# Altium schematic sheet S03-MICROPHONE.SchDoc
size B; SheetNumber: 4; SheetTotal: 5; BLOCK-TITLE: MICROPHONE AND ADJUSTABLE GAIN AMPLIFIER; BLOCK-SIZE: B; BLOCK-PROJECT: MULTIMOD AUDIO MODULE; BLOCK-REVISION: 1; BLOCK-ORGANIZATION: UNIVERSITY OF FLORIDA; BLOCK-DESIGNER: MEHRON TALEBI; BLOCK-IDENTIFIER: SUMMER 2023; BLOCK-REVIEWER: MIKE STAPLETON
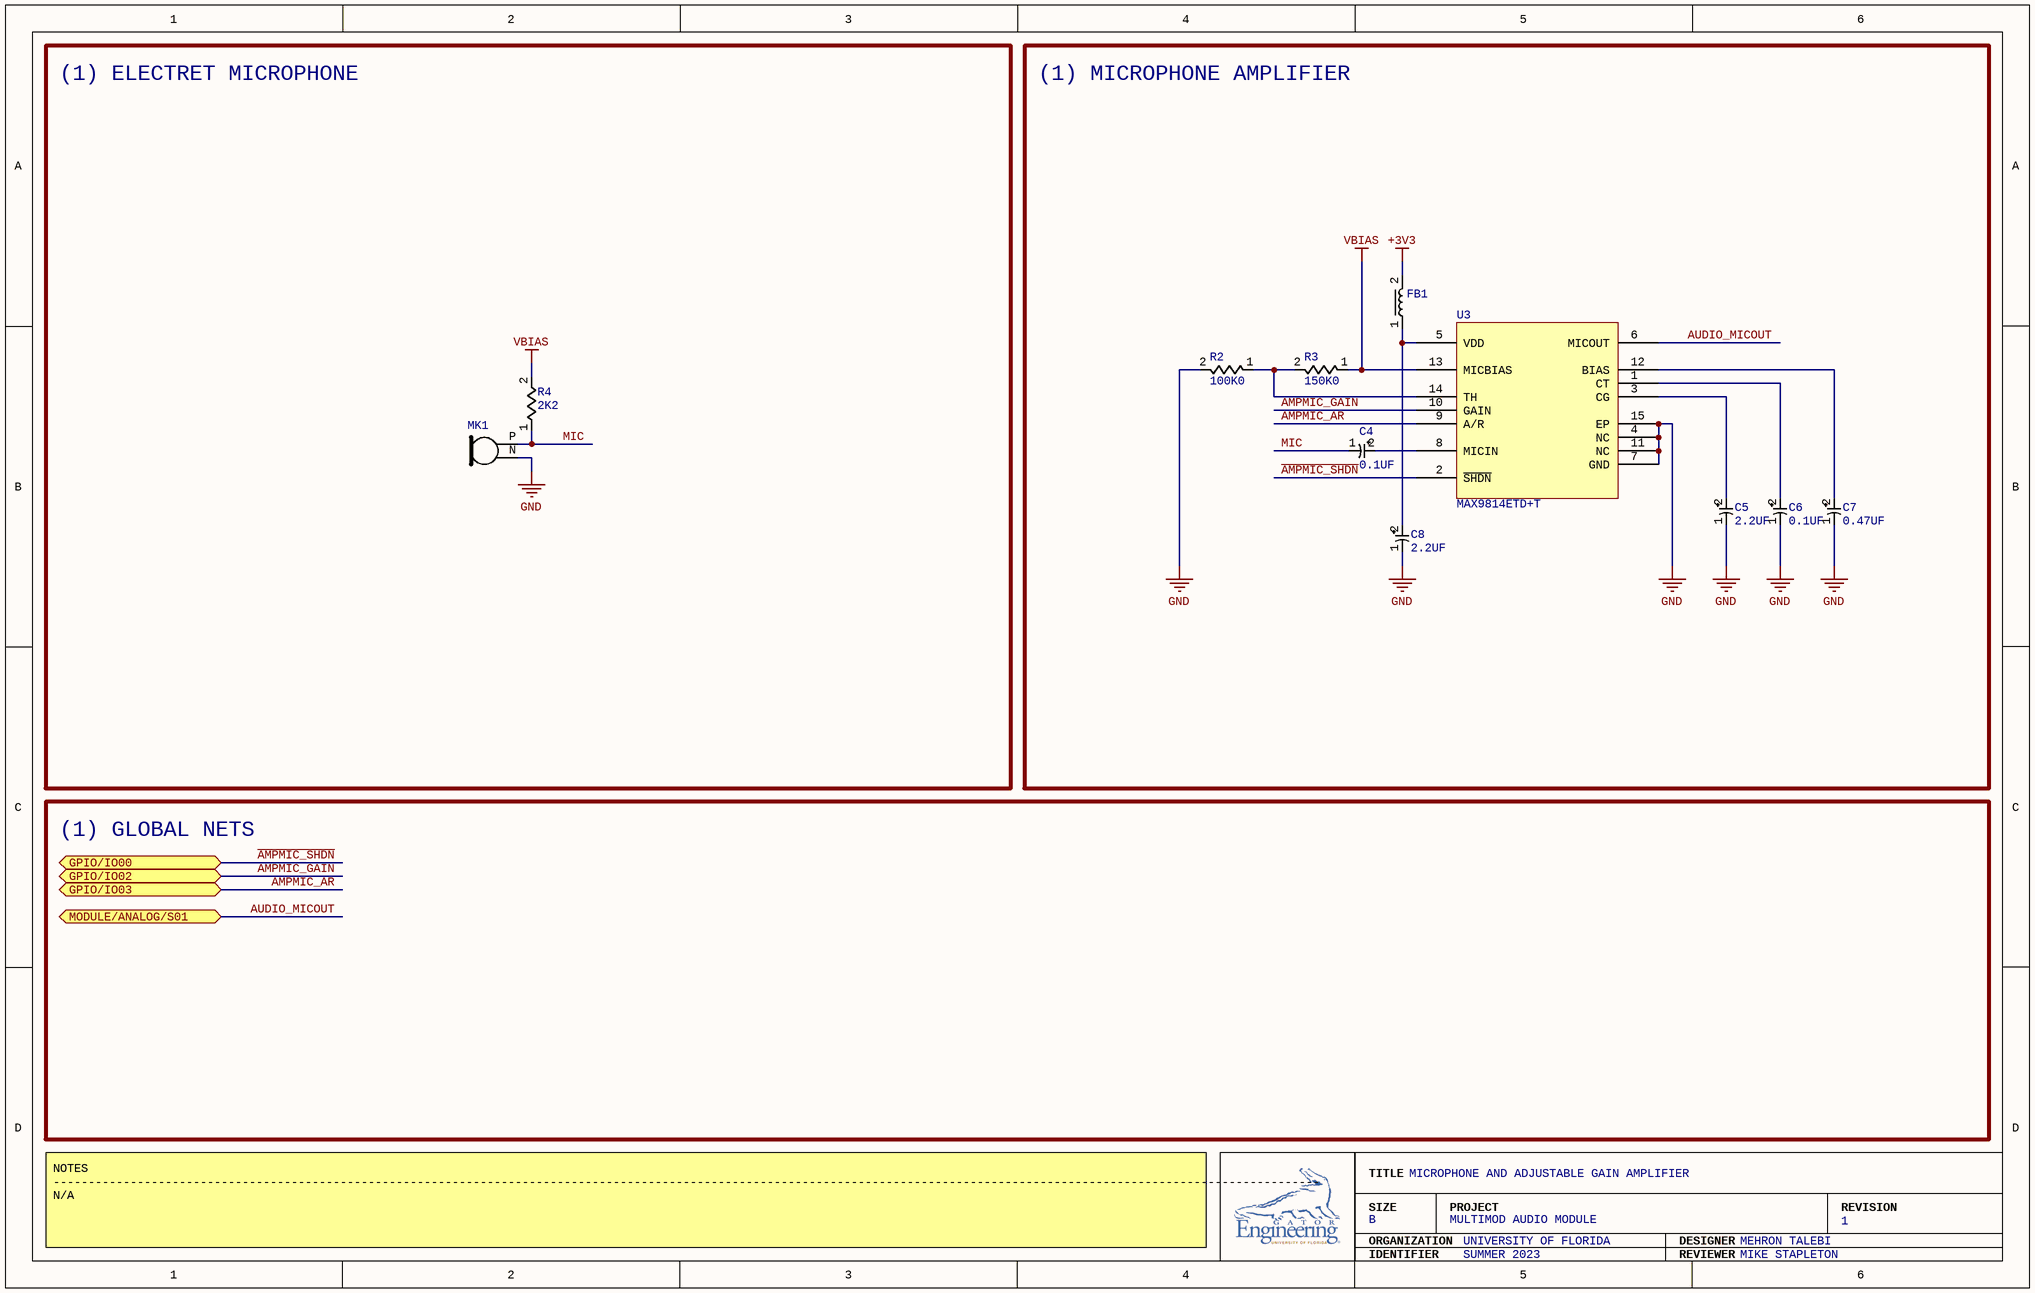
[diagram p0: S03-MICROPHONE.SchDoc]

## Parts
C4  0.1UF  [TAJR104K035RNJ]
C5  2.2UF  [TAJR225K020RNJ]
C6  0.1UF  [TAJR104K035RNJ]
C7  0.47UF  [TAJR474K020RNJ]
C8  2.2UF  [TAJR225K020RNJ]
FB1  ILBB0805ER102V  [ILBB0805ER102V]  (value not drawn)
MK1  CMA-4544PF-W  [CMA-4544PF-W]  (value not drawn)
R2  100K0  [RC0805FR-7W100KL]
R3  150K0  [RC0805FR-07150KL]
R4  2K2  [RC0805FR-072K2L]
U3  MAX9814ETD+T  [MAX9814ETD+T]

## Blocks framed on the sheet
(1) ELECTRET MICROPHONE: MK1 R4
(1) MICROPHONE AMPLIFIER: C4-C8 FB1 R2 R3 U3

## Ports
GPIO/IO00 (bidir), GPIO/IO02 (bidir), GPIO/IO03 (bidir), MODULE/ANALOG/S01 (bidir)

## Nets
+3V3: FB1.2
GND: C5.1 C6.1 C7.1 C8.1 MK1.N R2.2 U3.4(NC) U3.7(GND) U3.11(NC) U3.15(EP)
VBIAS: R3.1 R4.2 U3.13(MICBIAS)
~{AMPMIC_SHDN}: U3.2(~{SHDN}) ; port GPIO/IO00
AMPMIC_AR: U3.9(A/R) ; port GPIO/IO03
AMPMIC_GAIN: U3.10(GAIN) ; port GPIO/IO02
AUDIO_MICOUT: U3.6(MICOUT) ; port MODULE/ANALOG/S01
MIC: C4.1 MK1.P R4.1
NetC4_2: C4.2 U3.8(MICIN)
NetC5_2: C5.2 U3.3(CG)
NetC6_2: C6.2 U3.1(CT)
NetC7_2: C7.2 U3.12(BIAS)
NetC8_2: C8.2 FB1.1 U3.5(VDD)
NetR2_1: R2.1 R3.2 U3.14(TH)

## Notes on the sheet
- (1) GLOBAL NETS
- NOTES
  -------------------------------------------------------------------------------------------------------------------------------------------------------------------------------------
  N/A
- TITLE
- SIZE
- ORGANIZATION
- PROJECT
- DESIGNER
- REVISION
- IDENTIFIER
- REVIEWER

## Library data of the parts
C4 C6 = TAJR104K035RNJ: CAP TANT 0.1UF 10% 35V 0805; Manufacturer Size Code: R; Capacitance: 0.1 µF; Type: Molded; ESR (Equivalent Series Resistance): 29Ohm; Tolerance: ±10%; Voltage - Rated: 35 V; Operating Temperature: -55°C ~ 125°C; Mounting Type: Surface Mount; Package / Case: 0805 (2012 Metric); Size / Dimension: 0.081" L x 0.051" W (2.05mm x 1.30mm); Height - Seated (Max): 0.047" (1.20mm); Features: General Purpose; Supplier 1: Digi-Key; Supplier Part Number 1: 478-8926-1-ND
C5 C8 = TAJR225K020RNJ: CAP TANT 2.2UF 10% 20V 0805; Manufacturer Size Code: R; Capacitance: 2.2 µF; Type: Molded; ESR (Equivalent Series Resistance): 6Ohm; Tolerance: ±10%; Voltage - Rated: 20 V; Operating Temperature: -55°C ~ 125°C; Mounting Type: Surface Mount; Package / Case: 0805 (2012 Metric); Size / Dimension: 0.081" L x 0.051" W (2.05mm x 1.30mm); Height - Seated (Max): 0.047" (1.20mm); Features: General Purpose; Supplier 1: Digi-Key; Supplier Part Number 1: 478-4693-1-ND
C7 = TAJR474K020RNJ: CAP TANT 0.47UF 10% 20V 0805; Manufacturer Size Code: R; Capacitance: 0.47 µF; Type: Molded; ESR (Equivalent Series Resistance): 25Ohm; Tolerance: ±10%; Voltage - Rated: 20 V; Operating Temperature: -55°C ~ 125°C; Mounting Type: Surface Mount; Package / Case: 0805 (2012 Metric); Size / Dimension: 0.081" L x 0.051" W (2.05mm x 1.30mm); Height - Seated (Max): 0.047" (1.20mm); Features: General Purpose; Supplier 1: Digi-Key; Supplier Part Number 1: 478-3964-1-ND
FB1 = ILBB0805ER102V: FERRITE BEAD 1K OHM 0805 1LN; Number of Lines: 1; Impedance @ Frequency: 1 kOhms @ 100 MHz; Current Rating (Max): 100mA; DC Resistance (DCR) (Max): 350mOhm; Operating Temperature: -55°C ~ 125°C; Package / Case: 0805 (2012 Metric); Mounting Type: Surface Mount; Height (Max): 0.043" (1.10mm); Size / Dimension: 0.079" L x 0.049" W (2.00mm x 1.25mm); Supplier 1: Digi-Key; Supplier Part Number 1: 541-2293-1-ND
MK1 = CMA-4544PF-W: MIC COND ANLG OMNI -44DB 0.382"D; Output Type: Analog; Direction: Omnidirectional; Frequency Range: 20 Hz ~ 20 kHz; Sensitivity: -44dB ±2dB; S/N Ratio: 60dB; Impedance: 2.2 kOhms; Voltage Range: 3 V ~ 10 V; Current - Supply: 500 µA; Port Location: Top; Shape: Circular; Type: Electret Condenser; Termination: PC Pins; Size / Dimension: 0.382" Dia (9.70mm); Height (Max): 0.183" (4.65mm); Supplier 1: Arrow Electronics; Supplier Part Number 1: CMA-4544PF-W
R2 = RC0805FR-7W100KL: RES 100K OHM 1% 1/4W 0805; Resistance: 100 kOhms; Power (Watts): 0.25W, 1/4W; Temperature Coefficient: ±100ppm/°C; Tolerance: ±1%; Composition: Thick Film; Features: Moisture Resistant; Operating Temperature: -55°C ~ 155°C; Supplier Device Package: 0805; Size / Dimension: 0.079" L x 0.049" W (2.00mm x 1.25mm); Height - Seated (Max): 0.024" (0.60mm); Number of Terminations: 2; Supplier 1: Mouser; Supplier Part Number 1: 603-RC0805FR-7W100KL
R3 = RC0805FR-07150KL: RES 150K OHM 1% 1/8W 0805; Resistance: 150 kOhms; Power (Watts): 0.125W, 1/8W; Temperature Coefficient: ±100ppm/°C; Tolerance: ±1%; Composition: Thick Film; Features: Moisture Resistant; Operating Temperature: -55°C ~ 155°C; Package / Case: 0805 (2012 Metric); Supplier Device Package: 0805; Size / Dimension: 0.079" L x 0.049" W (2.00mm x 1.25mm); Height - Seated (Max): 0.024" (0.60mm); Number of Terminations: 2; Supplier 1: Digi-Key; Supplier Part Number 1: 311-150KCRDKR-ND
R4 = RC0805FR-072K2L: RES 2.2K OHM 1% 1/8W 0805; Resistance: 2.2 kOhms; Power (Watts): 0.125W, 1/8W; Temperature Coefficient: ±100ppm/°C; Tolerance: ±1%; Composition: Thick Film; Features: Moisture Resistant; Operating Temperature: -55°C ~ 155°C; Package / Case: 0805 (2012 Metric); Supplier Device Package: 0805; Size / Dimension: 0.079" L x 0.049" W (2.00mm x 1.25mm); Height - Seated (Max): 0.024" (0.60mm); Number of Terminations: 2; Supplier 1: Digi-Key; Supplier Part Number 1: 311-2.20KCRDKR-ND
U3 = MAX9814ETD+T: IC AMP CLASS AB MONO 14TDFN; Output Type: 1-Channel (Mono); Voltage - Supply: 2.7V ~ 5.5V; Type: Class AB; Features: AGC, Microphone, Shutdown; Mounting Type: Surface Mount; Operating Temperature: -40°C ~ 85°C (TA); Supplier Device Package: 14-TDFN (3x3); Package / Case: 14-WFDFN Exposed Pad; Supplier 1: Digi-Key; Supplier Part Number 1: MAX9814ETD+TCT-ND